# EAGLE schematic OLM-jee-ircam (EAGLE 6.4)
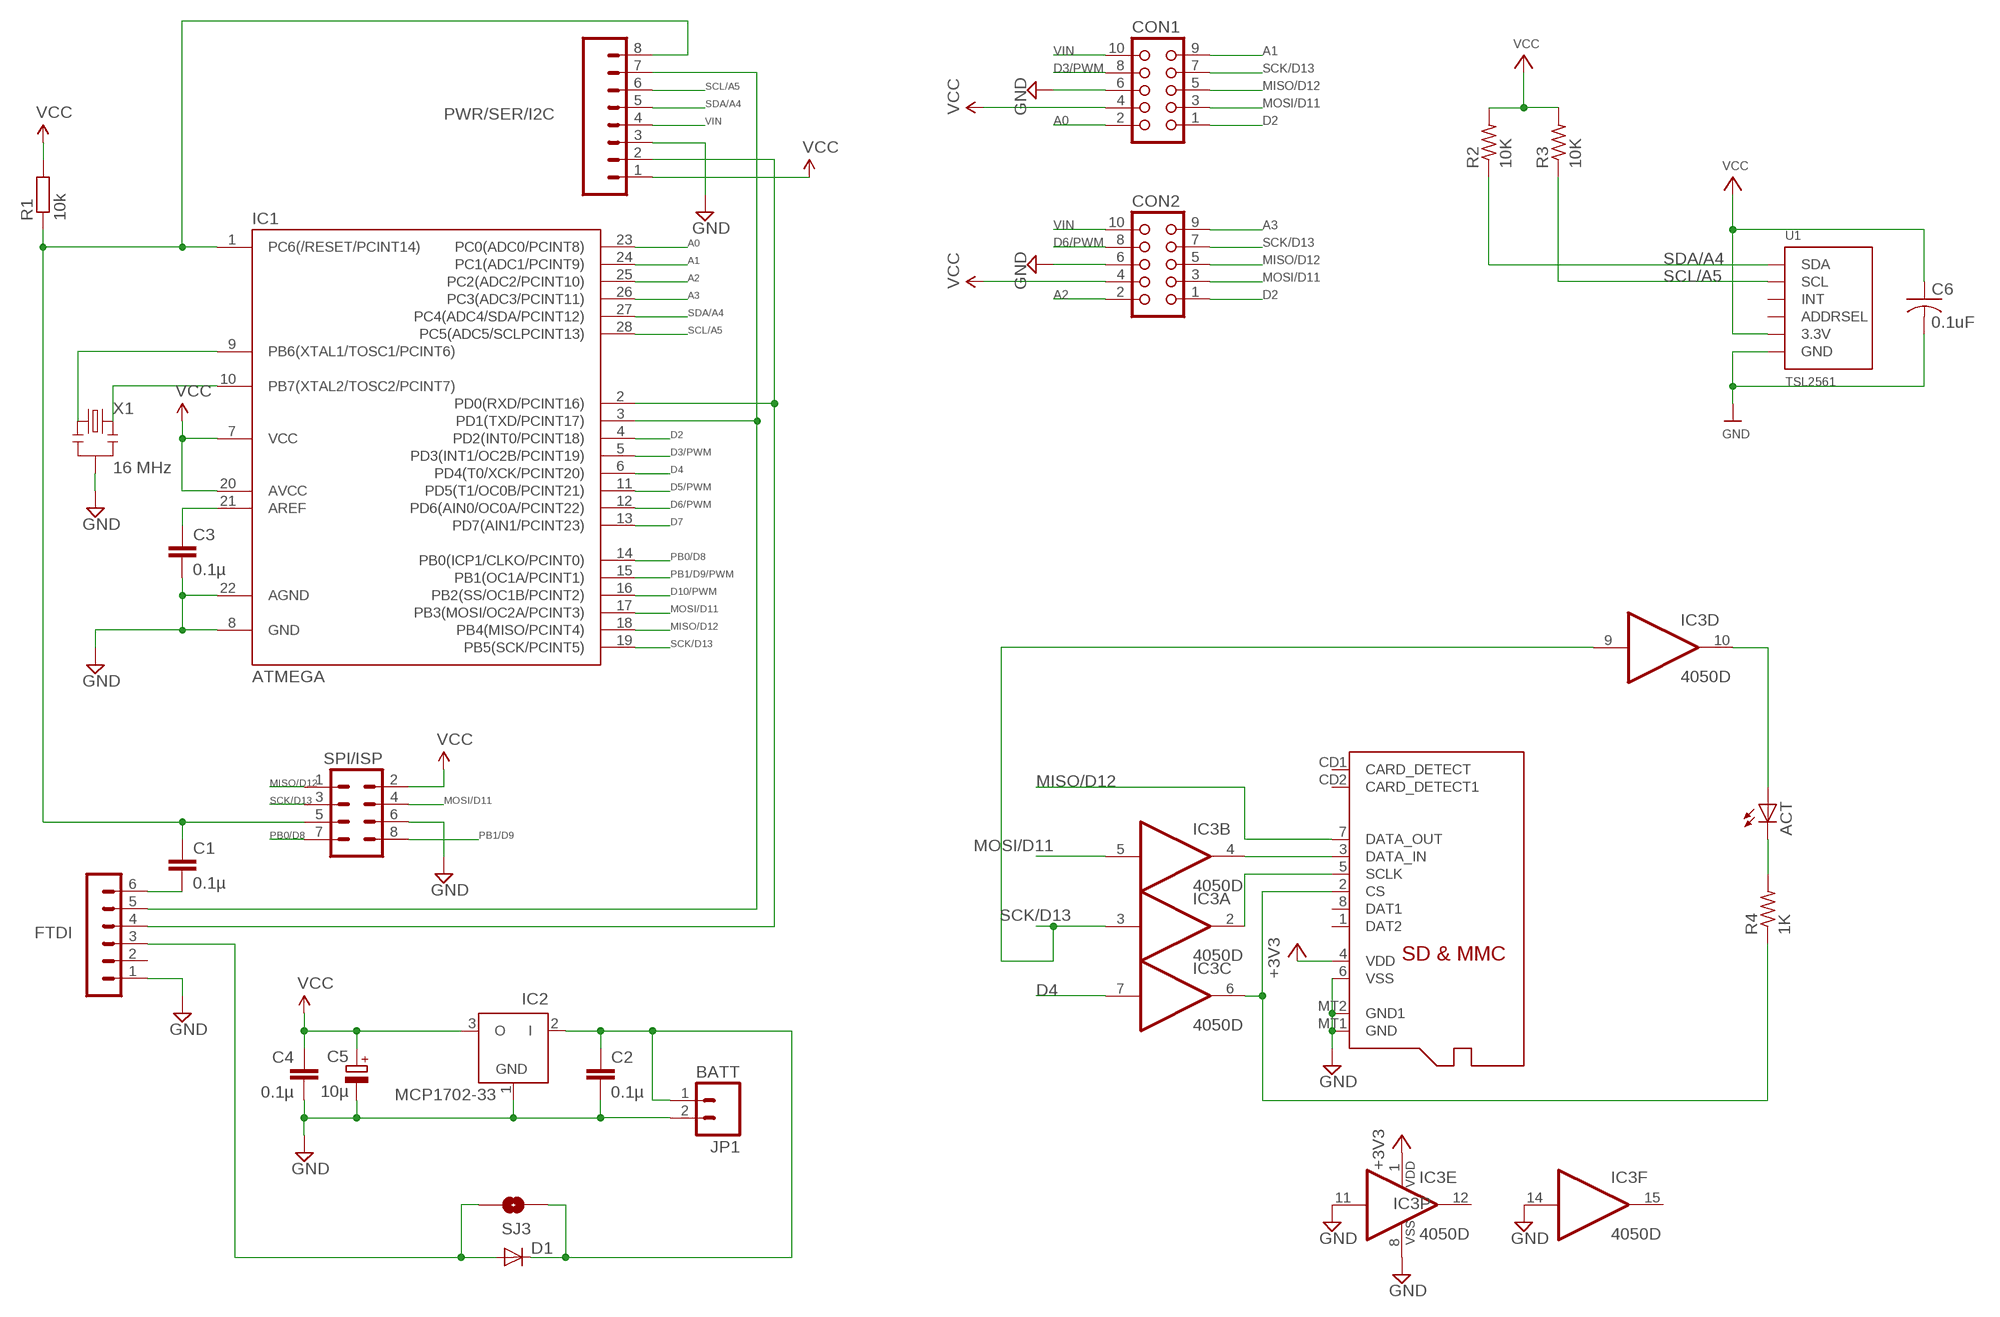
[diagram p0: schematic, sheet 1]

## Parts
ACT  LEDCHIP-LED0805  [CHIP-LED0805]
C1  0.1µ  C-EU025-024X044  [C025-024X044]
C2  0.1µ  C-EU025-024X044  [C025-024X044]
C3  0.1µ  C-EU025-024X044  [C025-024X044]
C4  0.1µ  C-EU025-024X044  [C025-024X044]
C5  10µ  CPOL-EUE1.8-4  [E1,8-4]
C6  0.1uF  C-USC0805  [C0805]
CON1  CON10L  [CON10L]
CON2  CON10L  [CON10L]
D1  DIODE-D-5  [D-5]
FTDI  FTDI  MA06-1  [MA06-1]
IC1  ATMEGA  ATMEGA48/88/168-PU  [DIL28-3]
IC2  MCP1702-33  MCP1702Z  [TO92]
IC3  4050D  [SO16]
JP1  BATT  M02LOCK_LONGPADS  [1X02_LOCK_LONGPADS]
PWR/SER/I2C  M08  [1X08]
R1  10k  R-EU_0204/7  [0204/7]
R2  10K  R-US_R0805  [R0805]
R3  10K  R-US_R0805  [R0805]
R4  1K  R-US_R0805  [R0805]
SJ3  SOLDERJUMPERTRACE  [SJ_2S-TRACE]
SV7  SPI/ISP  MA04-2  [MA04-2]
U1  TSL2561  [TSL2561_FN]
X1  16 MHz  RESONATORPTH  [RESONATOR-PTH]
X2  MICROSD  [MICROSD]

## Nets
+3V3: IC3.1(P:VDD) X2.4(VDD)
A0: CON1.2 IC1.23(PC0(ADC0/PCINT8))
A1: CON1.9 IC1.24(PC1(ADC1/PCINT9))
A2: CON2.2 IC1.25(PC2(ADC2/PCINT10))
A3: CON2.9 IC1.26(PC3(ADC3/PCINT11))
D2: CON1.1 CON2.1 IC1.4(PD2(INT0/PCINT18))
D3/PWM: CON1.8 IC1.5(PD3(INT1/OC2B/PCINT19))
D4: IC1.6(PD4(T0/XCK/PCINT20)) IC3.7(C:I)
D5/PWM: IC1.11(PD5(T1/OC0B/PCINT21))
D6/PWM: CON2.8 IC1.12(PD6(AIN0/OC0A/PCINT22))
D7: IC1.13(PD7(AIN1/PCINT23))
D10/PWM: IC1.16(PB2(SS/OC1B/PCINT2))
GND [power]: C2.2 C3.2 C4.2 C5.- C6.2 CON1.6 CON2.6 FTDI.1 IC1.8(GND) IC1.22(AGND) IC2.1(GND) IC3.8(P:VSS) IC3.11(E:I) IC3.14(F:I) JP1.2 PWR/SER/I2C.3 SV7.6 U1.VSS(GND) X1.2 X2.6(VSS) X2.MT1(GND) X2.MT2(GND1)
MISO/D12: CON1.5 CON2.5 IC1.18(PB4(MISO/PCINT4)) SV7.1 X2.7(DATA_OUT)
MOSI/D11: CON1.3 CON2.3 IC1.17(PB3(MOSI/OC2A/PCINT3)) IC3.5(B:I) SV7.4
N$1: IC1.9(PB6(XTAL1/TOSC1/PCINT6)) X1.1
N$2: ACT.A IC3.10(D:O)
N$3: IC3.2(A:O) X2.5(SCLK)
N$4: FTDI.5 IC1.3(PD1(TXD/PCINT17)) PWR/SER/I2C.7
N$5: IC3.6(C:O) R4.1 X2.2(CS)
N$6: ACT.C R4.2
N$7: FTDI.4 IC1.2(PD0(RXD/PCINT16)) PWR/SER/I2C.2
N$8: IC3.4(B:O) X2.3(DATA_IN)
N$12 [power]: D1.A FTDI.3 SJ3.2
N$16 [power]: C2.1 D1.C IC2.2(I) JP1.1 SJ3.1
N$19: C3.1 IC1.21(AREF)
N$20: C1.2 FTDI.6
N$21: IC1.10(PB7(XTAL2/TOSC2/PCINT7)) X1.3
PB0/D8: IC1.14(PB0(ICP1/CLKO/PCINT0)) SV7.7
PB1/D9: SV7.8
PB1/D9/PWM: IC1.15(PB1(OC1A/PCINT1))
RESET: C1.1 IC1.1(PC6(/RESET/PCINT14)) PWR/SER/I2C.8 R1.1 SV7.5
SCK/D13: CON1.7 CON2.7 IC1.19(PB5(SCK/PCINT5)) IC3.3(A:I) IC3.9(D:I) SV7.3
SCL/A5: IC1.28(PC5(ADC5/SCLPCINT13)) PWR/SER/I2C.6 R3.1 U1.CLK(SCL)
SDA/A4: IC1.27(PC4(ADC4/SDA/PCINT12)) PWR/SER/I2C.5 R2.1 U1.DATA(SDA)
VCC [power]: C4.1 C5.+ C6.1 CON1.4 CON2.4 IC1.7(VCC) IC1.20(AVCC) IC2.3(O) PWR/SER/I2C.1 R1.2 R2.2 R3.2 SV7.2 U1.VDD(3.3V)
VIN: CON1.10 CON2.10 PWR/SER/I2C.4
Unconnected: FTDI.2 IC3.12(E:O) IC3.15(F:O) U1.ADR(ADDRSEL) U1.INT X2.1(DAT2) X2.8(DAT1) X2.CD1(CARD_DETECT) X2.CD2(CARD_DETECT1)

## Library data of the parts
ACT = adafruit:LED: LED OSRAM: - CHIPLED LG R971, LG N971, LY N971, LG Q971, LY Q971, LO R971, LY R971 LH N974, LH R974 LS Q976, LO Q976, LY Q976 LO Q996 - Hyper CHIPLED LW Q18S LB Q993, LB Q99A, LB R99A - SideLED LS A670, LO A670, LY A670, LG A670, LP A670 LB A673, LV A673, LT A673, LW A673 LH A674 LY A675 LS A676, LA A676, LO A676, LY A676, LW A676 LS A679, LY A679, LG A679 - Hyper Micro SIDELED® LS Y876, LA Y876, LO Y876, LY Y876 LT Y87S - SmartLED LW L88C, LW L88S LB L89C, LB L89S, LG L890 LS L89K, LO L89K, LY L89K LS L896, LA L896, LO L896, LY L896 - TOPLED LS T670, LO T670, LY T670, LG T670, LP T670 LSG T670, LSP T670, LSY T670, LOP T670, LYG T670 LG T671, LOG T671, LSG T671 LB T673, LV T673, LT T673, LW T673 LH T674 LS T676, LA T676, LO T676, LY T676, LB T676, LH T676, LSB T676, LW T676 LB T67C, LV T67C, LT T67C, LS T67K, LO T67K, LY T67K, LW E67C LS E67B, LA E67B, LO E67B, LY E67B, LB E67C, LV E67C, LT E67C LW T67C LS T679, LY T679, LG T679 LS T770, LO T770, LY T770, LG T770, LP T770 LB T773, LV T773, LT T773, LW T773 LH T774 LS E675, LA E675, LY E675, LS T675 LS T776, LA T776, LO T776, LY T776, LB T776 LHGB T686 LT T68C, LB T68C - Hyper Mini TOPLED® LB M676 - Mini TOPLED Santana® LG M470 LS M47K, LO M47K, LY M47K Source: http://www.osram.convergy.de/
C1-C4 = resistor:C-EU: CAPACITOR, European symbol
C5 = resistor:CPOL-EU: POLARIZED CAPACITOR, European symbol
C6 = adafruit:C-US: CAPACITOR, American symbol
CON1 CON2 = con-harting:CON10L: CONNECTOR; OC_FARNELL: unknown; OC_NEWARK: unknown
D1 = diode:DIODE-: DIODE
FTDI = JeeLabs:MA06-1: PIN HEADER
IC1 = atmega8:ATMEGA48/88/168-PU
IC2 = JeeLabs:MCP1702: 200 mA, Low Power Low Dropout Voltage Regulator
IC3 = 40xx:4050: Hex non-inverting BUFFER
JP1 = SparkFun:M02: Header 2 Standard 2-pin 0.1" header. Use with straight break away headers (SKU : PRT-00116), right angle break away headers (PRT-00553), swiss pins (PRT-00743), machine pins (PRT-00117), and female headers (PRT-00115). Molex polarized connector foot print use with SKU : PRT-08233 with associated crimp pins and housings.
PWR/SER/I2C = SparkFun:M08: Header 8 Standard 8-pin 0.1" header. Use with straight break away headers (SKU : PRT-00116), right angle break away headers (PRT-00553), swiss pins (PRT-00743), machine pins (PRT-00117), and female headers (PRT-00115).
R1 = resistor:R-EU_: RESISTOR, European symbol
R2-R4 = adafruit:R-US_: RESISTOR, American symbol
SJ3 = SparkFun:SOLDERJUMPER: Solder Jumper Standard SMD solder jumper. Used to automate production. Two varients : Normally Open and Normally Closed are the same, but have different paste layers. NC will have a large amount of paste and should jumper during reflow.
SV7 = JeeLabs:MA04-2: PIN HEADER
U1 = microbuilder:TSL2561: TSL2561 Light-To-Digital Sensor Mouser Part Numbers: CS (obsolete): 856-TSL2561CS DFN (cheapest): 856-TSL2561FN
X1 = SparkFun:RESONATOR: Resonator Small SMD resonator. This is the itty bitty 10/20MHz resonators with built in caps. CSTCE10M0G55 and CSTCE20M0V53. Footprint has been reviewed closely but hasn't been tested yet.
X2 = adafruit:MICROSD: Micro-SD / Transflash card holder with SPI pinout For the 3M # 2908-05WB-MG and/or 4UCON #19656 push-push type

## Net classes
1 power: width 0.813 mm, clearance 0.203 mm